# Altium schematic sheet ver060_SignalAnalog.SchDoc
size A3; SheetNumber: 2; SheetTotal: 6
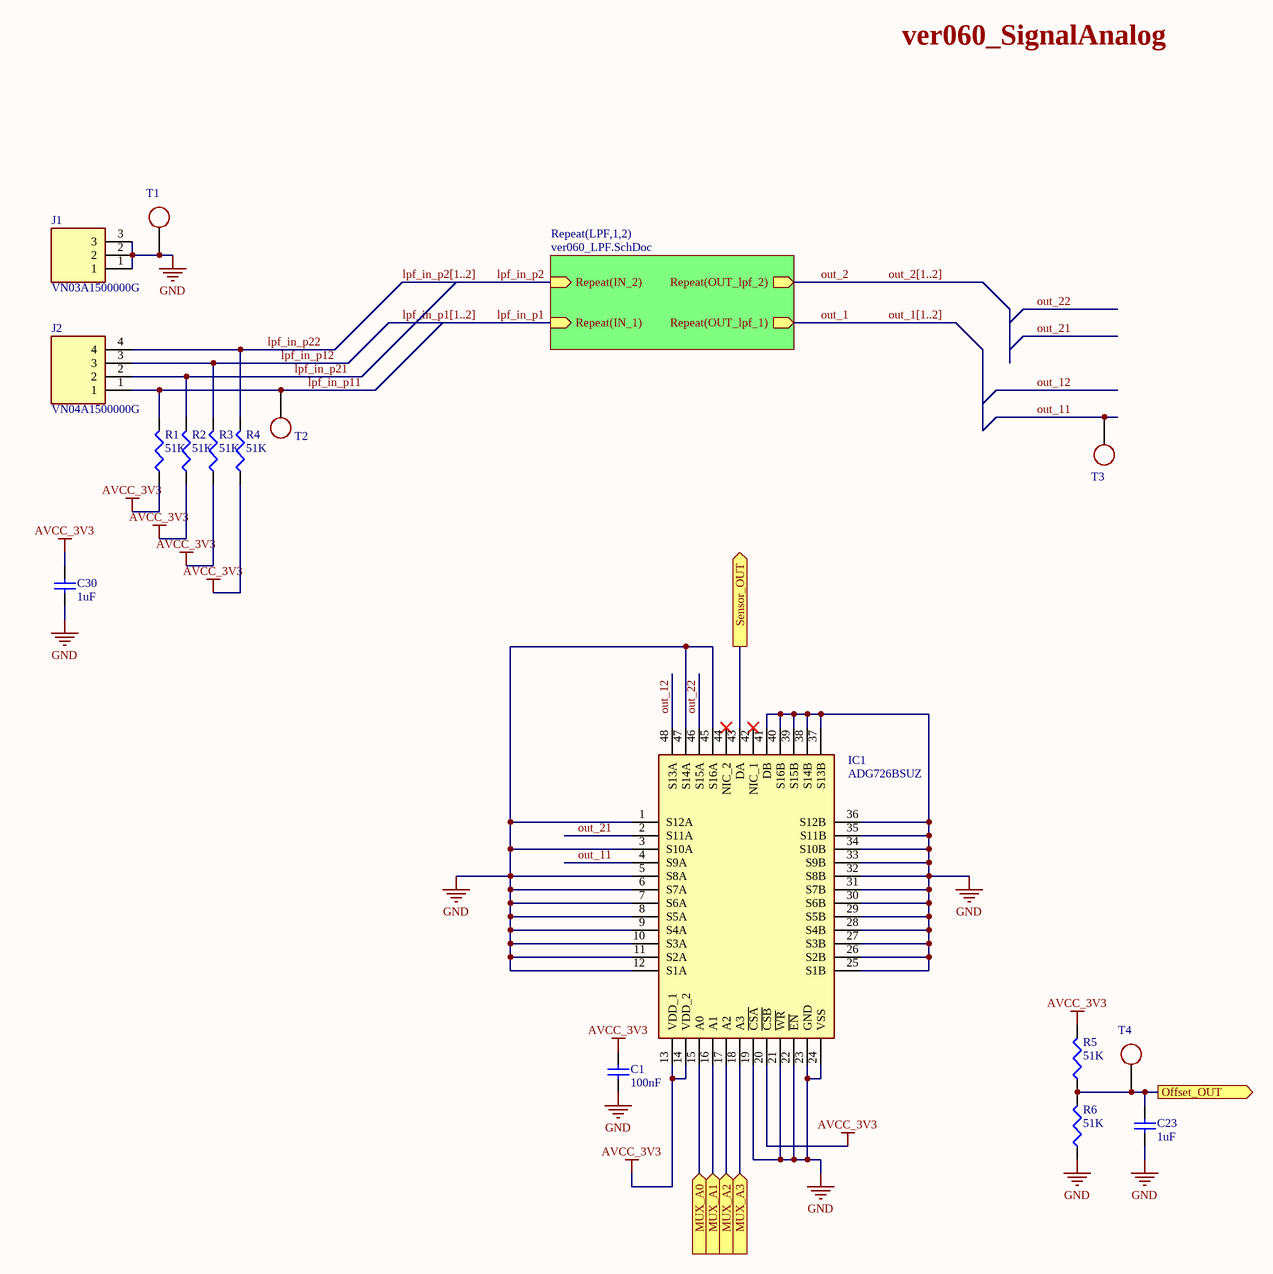
[diagram p0: ver060_SignalAnalog.SchDoc]

## Parts
C1  value 100nF  [1608[0603]]  (hidden comment: Cap Semi)
C23  value 1uF  [1608[0603]]  (hidden comment: Cap Semi)
C30  value 1uF  [1608[0603]]  (hidden comment: Cap Semi)
IC1  ADG726BSUZ  [QFP50P900X900X120-48N]
J1  VN03A1500000G  [VN03A1500000G]
J2  VN04A1500000G  [VN04A1500000G]
R1  value 51K  [J1-0603]  (hidden comment: Res3)
R2  value 51K  [J1-0603]  (hidden comment: Res3)
R3  value 51K  [J1-0603]  (hidden comment: Res3)
R4  value 51K  [J1-0603]  (hidden comment: Res3)
R5  value 51K  [J1-0603]  (hidden comment: Res3)
R6  value 51K  [J1-0603]  (hidden comment: Res3)
T1  TP_SMT  [TP_SMT_Round_0.6x0.6]  (value not drawn)
T2  TP_SMT  [TP_SMT_Round_0.6x0.6]  (value not drawn)
T3  TP_SMT  [TP_SMT_Round_0.6x0.6]  (value not drawn)
T4  TP_SMT  [TP_SMT_Round_0.6x0.6]  (value not drawn)

## Sub-sheets
Repeat(LPF,1,2) = ver060_LPF.SchDoc: Repeat(IN_1) (in), Repeat(IN_2) (in), Repeat(OUT_lpf_2) (out), Repeat(OUT_lpf_1) (out)

## Ports
MUX_A0 (in), MUX_A1 (in), MUX_A2 (in), MUX_A3 (in), Offset_OUT (out), Sensor_OUT (out)

## Nets
AVCC_3V3: C1.2 C30.2 IC1.13(VDD_1) IC1.14(VDD_2) IC1.20(~{CSB}) R1.1 R2.1 R3.1 R4.1 R5.2
GND: C1.1 C23.1 C30.1 IC1.1(S12A) IC1.3(S10A) IC1.5(S8A) IC1.6(S7A) IC1.7(S6A) IC1.8(S5A) IC1.9(S4A) IC1.10(S3A) IC1.11(S2A) IC1.12(S1A) IC1.19(~{CSA}) IC1.21(~{WR}) IC1.22(~{EN}) IC1.23(GND) IC1.24(VSS) IC1.25(S1B) IC1.26(S2B) IC1.27(S3B) IC1.28(S4B) IC1.29(S5B) IC1.30(S6B) IC1.31(S7B) IC1.32(S8B) IC1.33(S9B) IC1.34(S10B) IC1.35(S11B) IC1.36(S12B) IC1.37(S13B) IC1.38(S14B) IC1.39(S15B) IC1.40(S16B) IC1.41(DB) IC1.45(S16A) IC1.47(S14A) J1.1 J1.2 J1.3 R6.1 T1.1
lpf_in_p1: sheet Repeat(LPF,1,2)/Repeat(IN_1)
lpf_in_p2: sheet Repeat(LPF,1,2)/Repeat(IN_2)
lpf_in_p11: J2.1 R1.2 T2.1
lpf_in_p12: J2.3 R3.2
lpf_in_p21: J2.2 R2.2
lpf_in_p22: J2.4 R4.2
MUX_A0: IC1.15(A0) ; port MUX_A0
MUX_A1: IC1.16(A1) ; port MUX_A1
MUX_A2: IC1.17(A2) ; port MUX_A2
MUX_A3: IC1.18(A3) ; port MUX_A3
Offset_OUT: C23.2 R5.1 R6.2 T4.1 ; port Offset_OUT
out_1: sheet Repeat(LPF,1,2)/Repeat(OUT_lpf_1)
out_2: sheet Repeat(LPF,1,2)/Repeat(OUT_lpf_2)
out_11: IC1.4(S9A) T3.1
out_12: IC1.48(S13A)
out_21: IC1.2(S11A)
out_22: IC1.46(S15A)
Sensor_OUT: IC1.43(DA) ; port Sensor_OUT

Not connected (* = marked no-connect by the designer): IC1 42(NIC_1)* 44(NIC_2)*

## Buses and harness runs
bus lpf_in_p1[1..2]
bus lpf_in_p2[1..2]
bus out_1[1..2]
bus out_2[1..2]

## Notes on the sheet
- ver060_SignalAnalog

## Library data of the parts
C1 C23 C30 = Cap Semi: Capacitor (Semiconductor SIM Model); Published: 8-Jun-2000; LatestRevisionDate: 29-May-2009; LatestRevisionNote: IPC-7351 Footprint Added.; PackageReference: C1206; Publisher: Altium Limited; PackageDescription: Chip Capacitor
IC1 = ADG726BSUZ: Integrated Circuit; Manufacturer_Name: Analog Devices; Datasheet Link: https://www.analog.com/media/en/technical-documentation/data-sheets/ADG726_732.pdf; Height: 1.2mm; Manufacturer_Part_Number: ADG726BSUZ; Mouser Part Number: 584-ADG726BSUZ; Mouser Price/Stock: https://www.mouser.co.uk/ProductDetail/Analog-Devices/ADG726BSUZ?qs=BpaRKvA4VqHCQkaid0DsDg%3D%3D; Arrow Part Number: ADG726BSUZ; Arrow Price/Stock: https://www.arrow.com/en/products/adg726bsuz/analog-devices?region=nac
J1 = VN03A1500000G: Connector; Manufacturer_Name: Amphenol; Datasheet Link: https://eu.mouser.com/datasheet/2/18/9COuFx9FNOAv-1379191.pdf; Height: 8.8mm; Manufacturer_Part_Number: VN03A1500000G; Mouser Part Number: 649-VN03A15000J0G; Mouser Price/Stock: https://www.mouser.co.uk/ProductDetail/Amphenol-Anytek/VN03A1500000G?qs=Mv7BduZupUh59KeTY610Jg%3D%3D
J2 = VN04A1500000G: Connector; Manufacturer_Name: Amphenol; Datasheet Link: https://eu.mouser.com/datasheet/2/18/9COuFx9FNOAv-1379191.pdf; Height: 8.5mm; Manufacturer_Part_Number: VN04A1500000G; Mouser Part Number: 649-VN04A15000J0G; Mouser Price/Stock: https://www.mouser.co.uk/ProductDetail/Amphenol-Anytek/VN04A1500000G?qs=Mv7BduZupUg1gSttWAc7xA%3D%3D
R1-R6 = Res3: Resistor; Published: 8-Jun-2000; LatestRevisionDate: 29-May-2009; LatestRevisionNote: IPC-7351 Footprint Added.; PackageReference: J1-0603; Publisher: Altium Limited; PackageDescription: Chip Resistor